# EAGLE design OpenServoDrive (EAGLE 6.3)
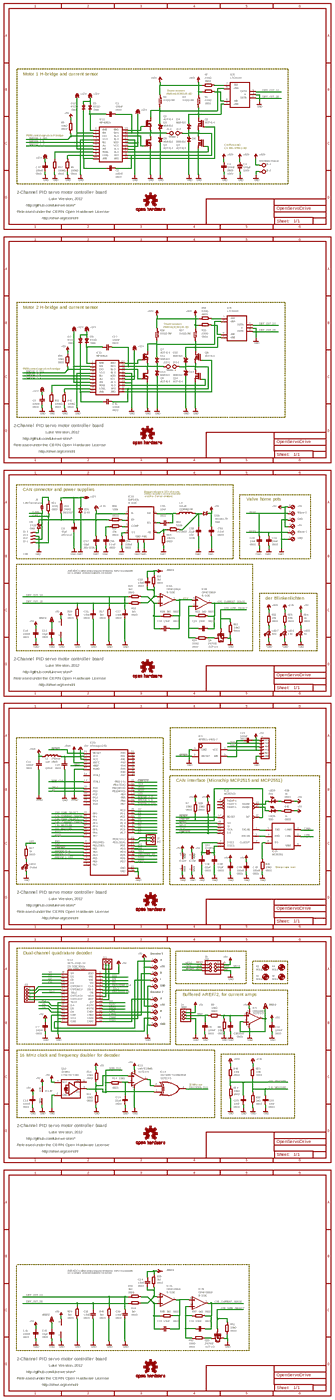
[diagram p0: schematic, sheet 1, overview]
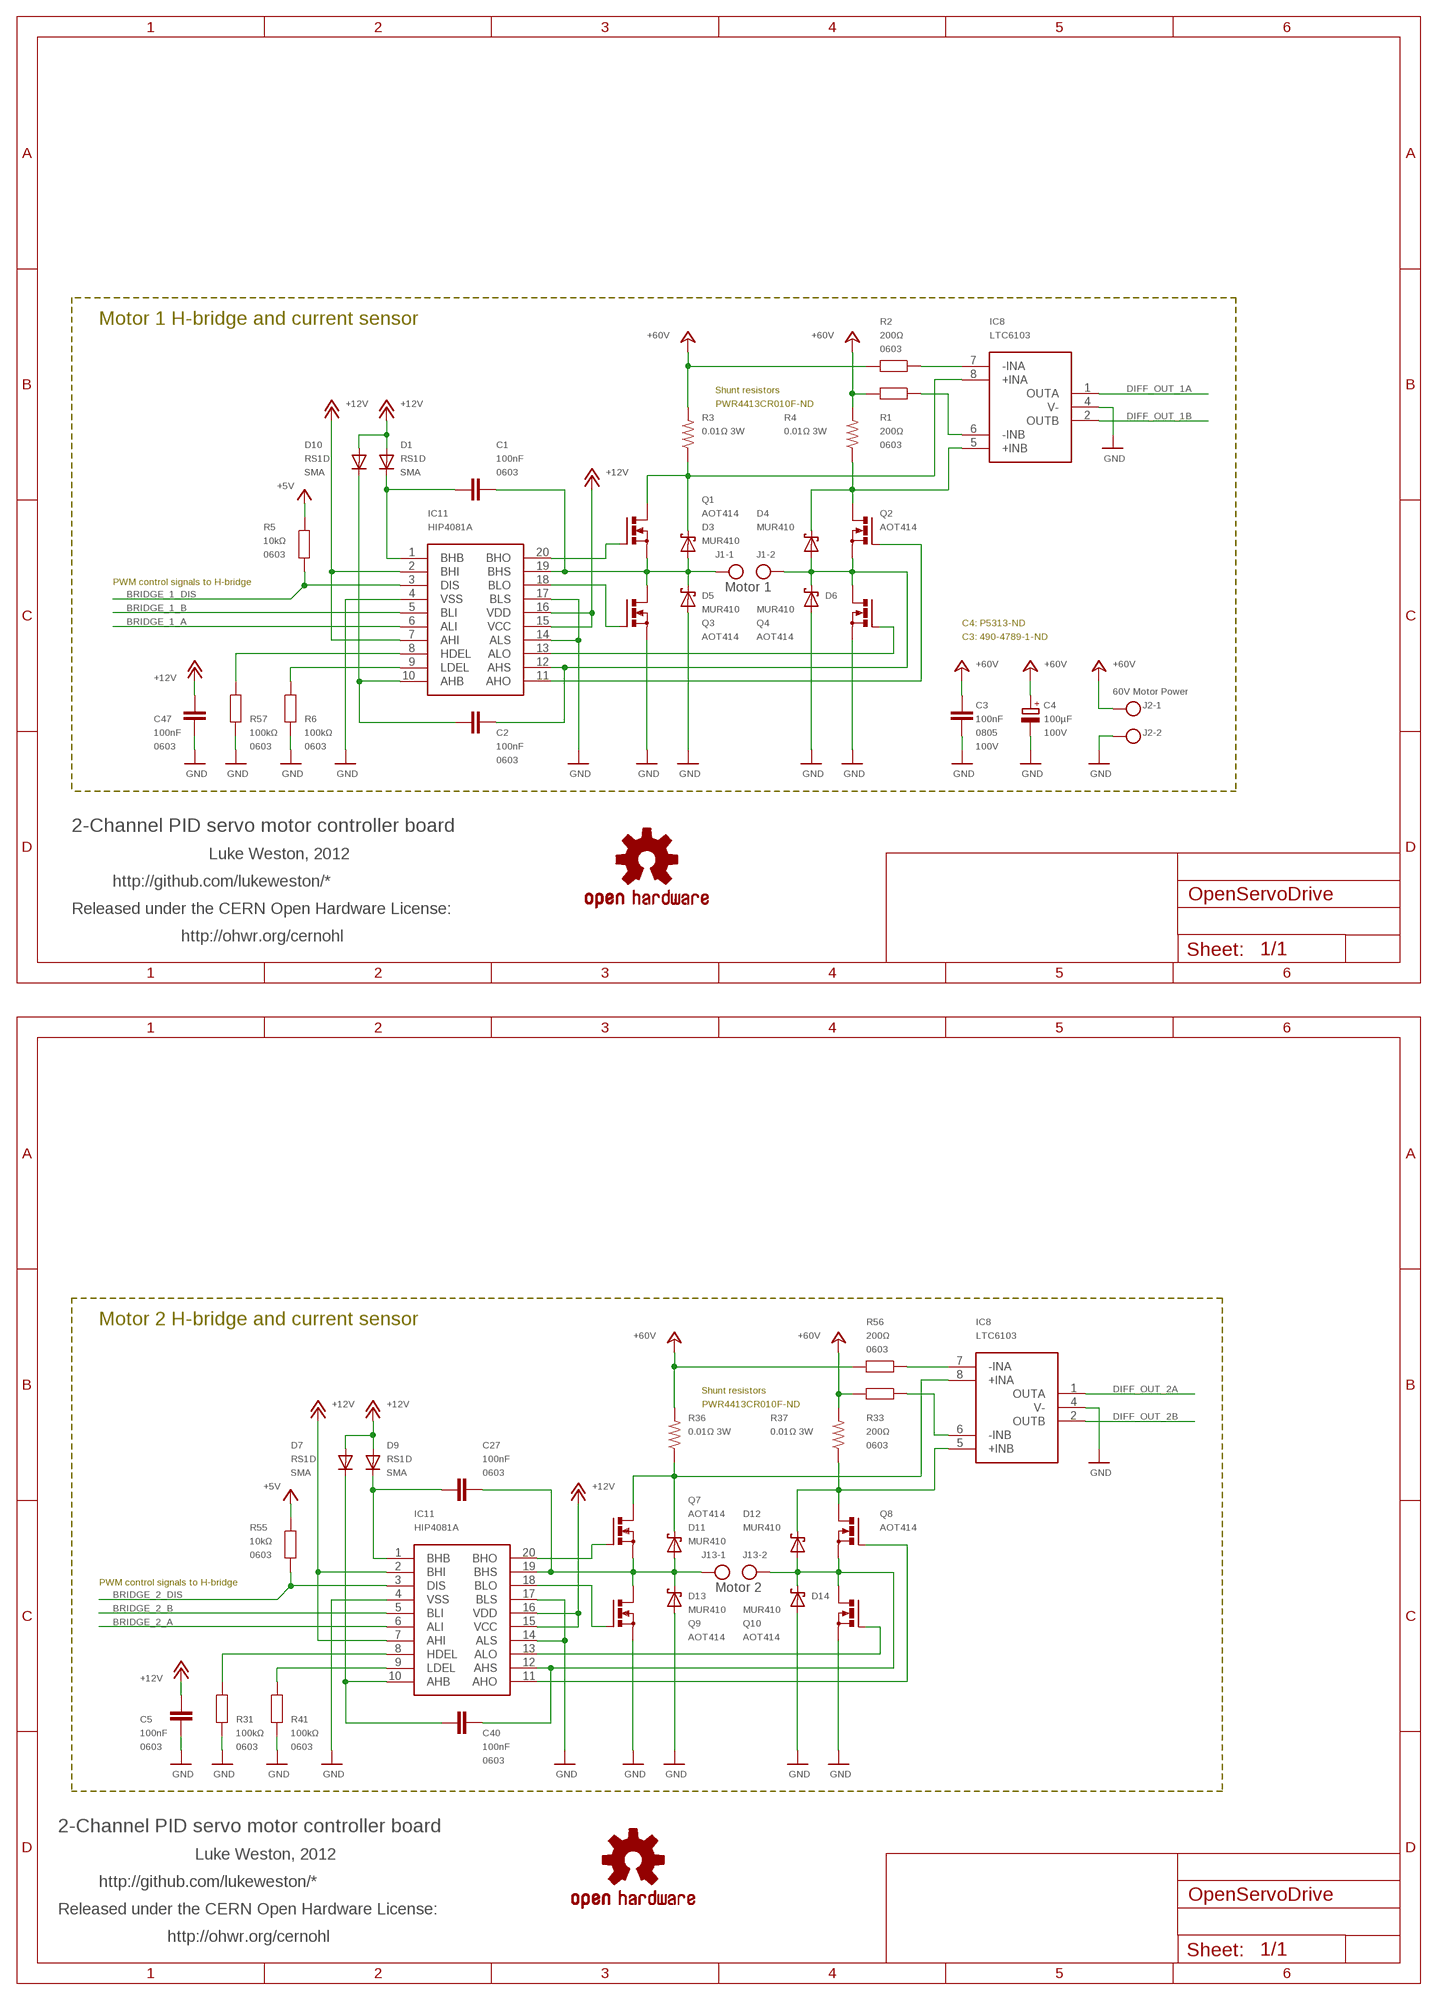
[diagram p1: schematic, sheet 1, part 1 of 4]
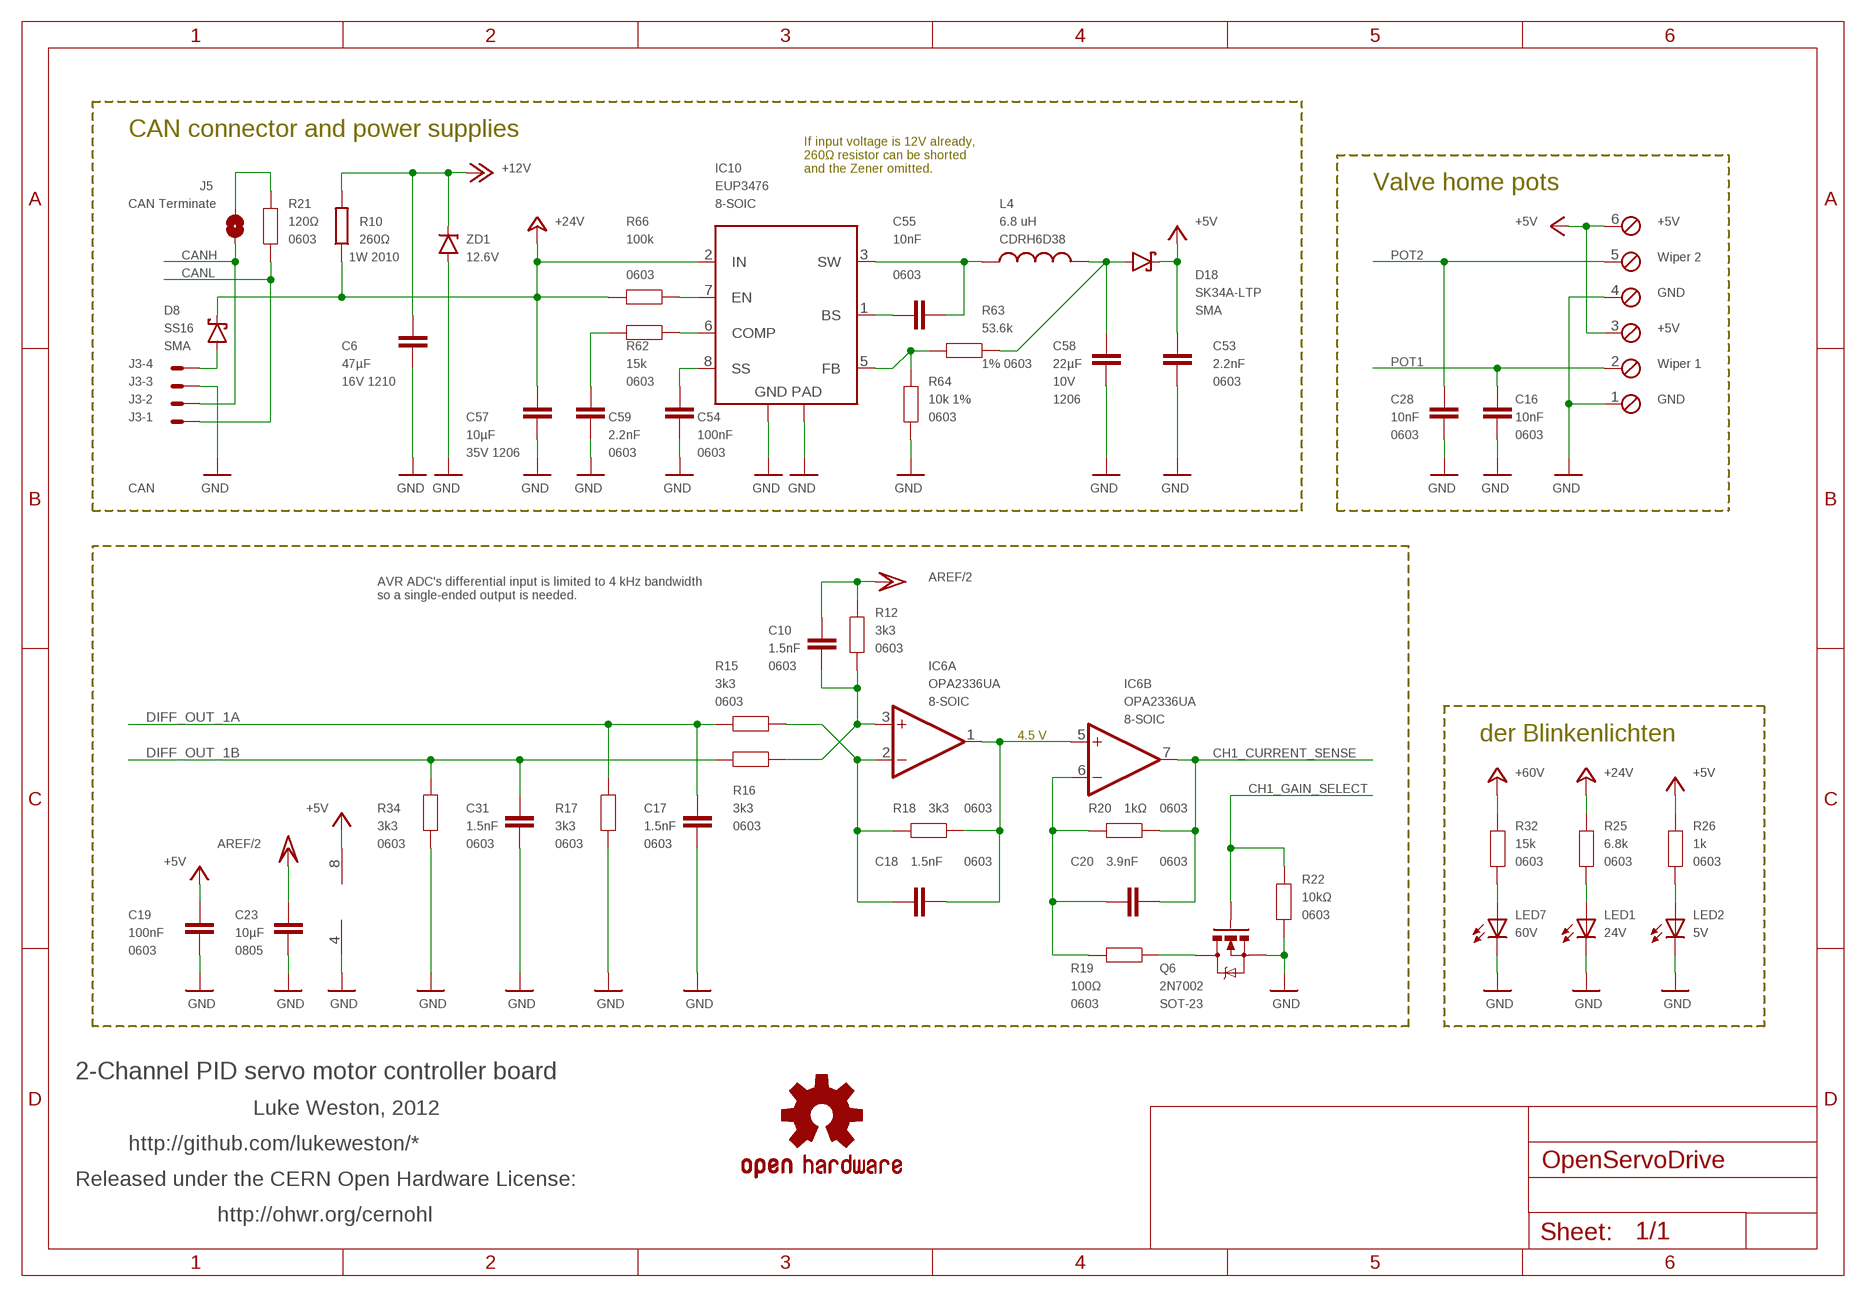
[diagram p2: schematic, sheet 1, part 2 of 4]
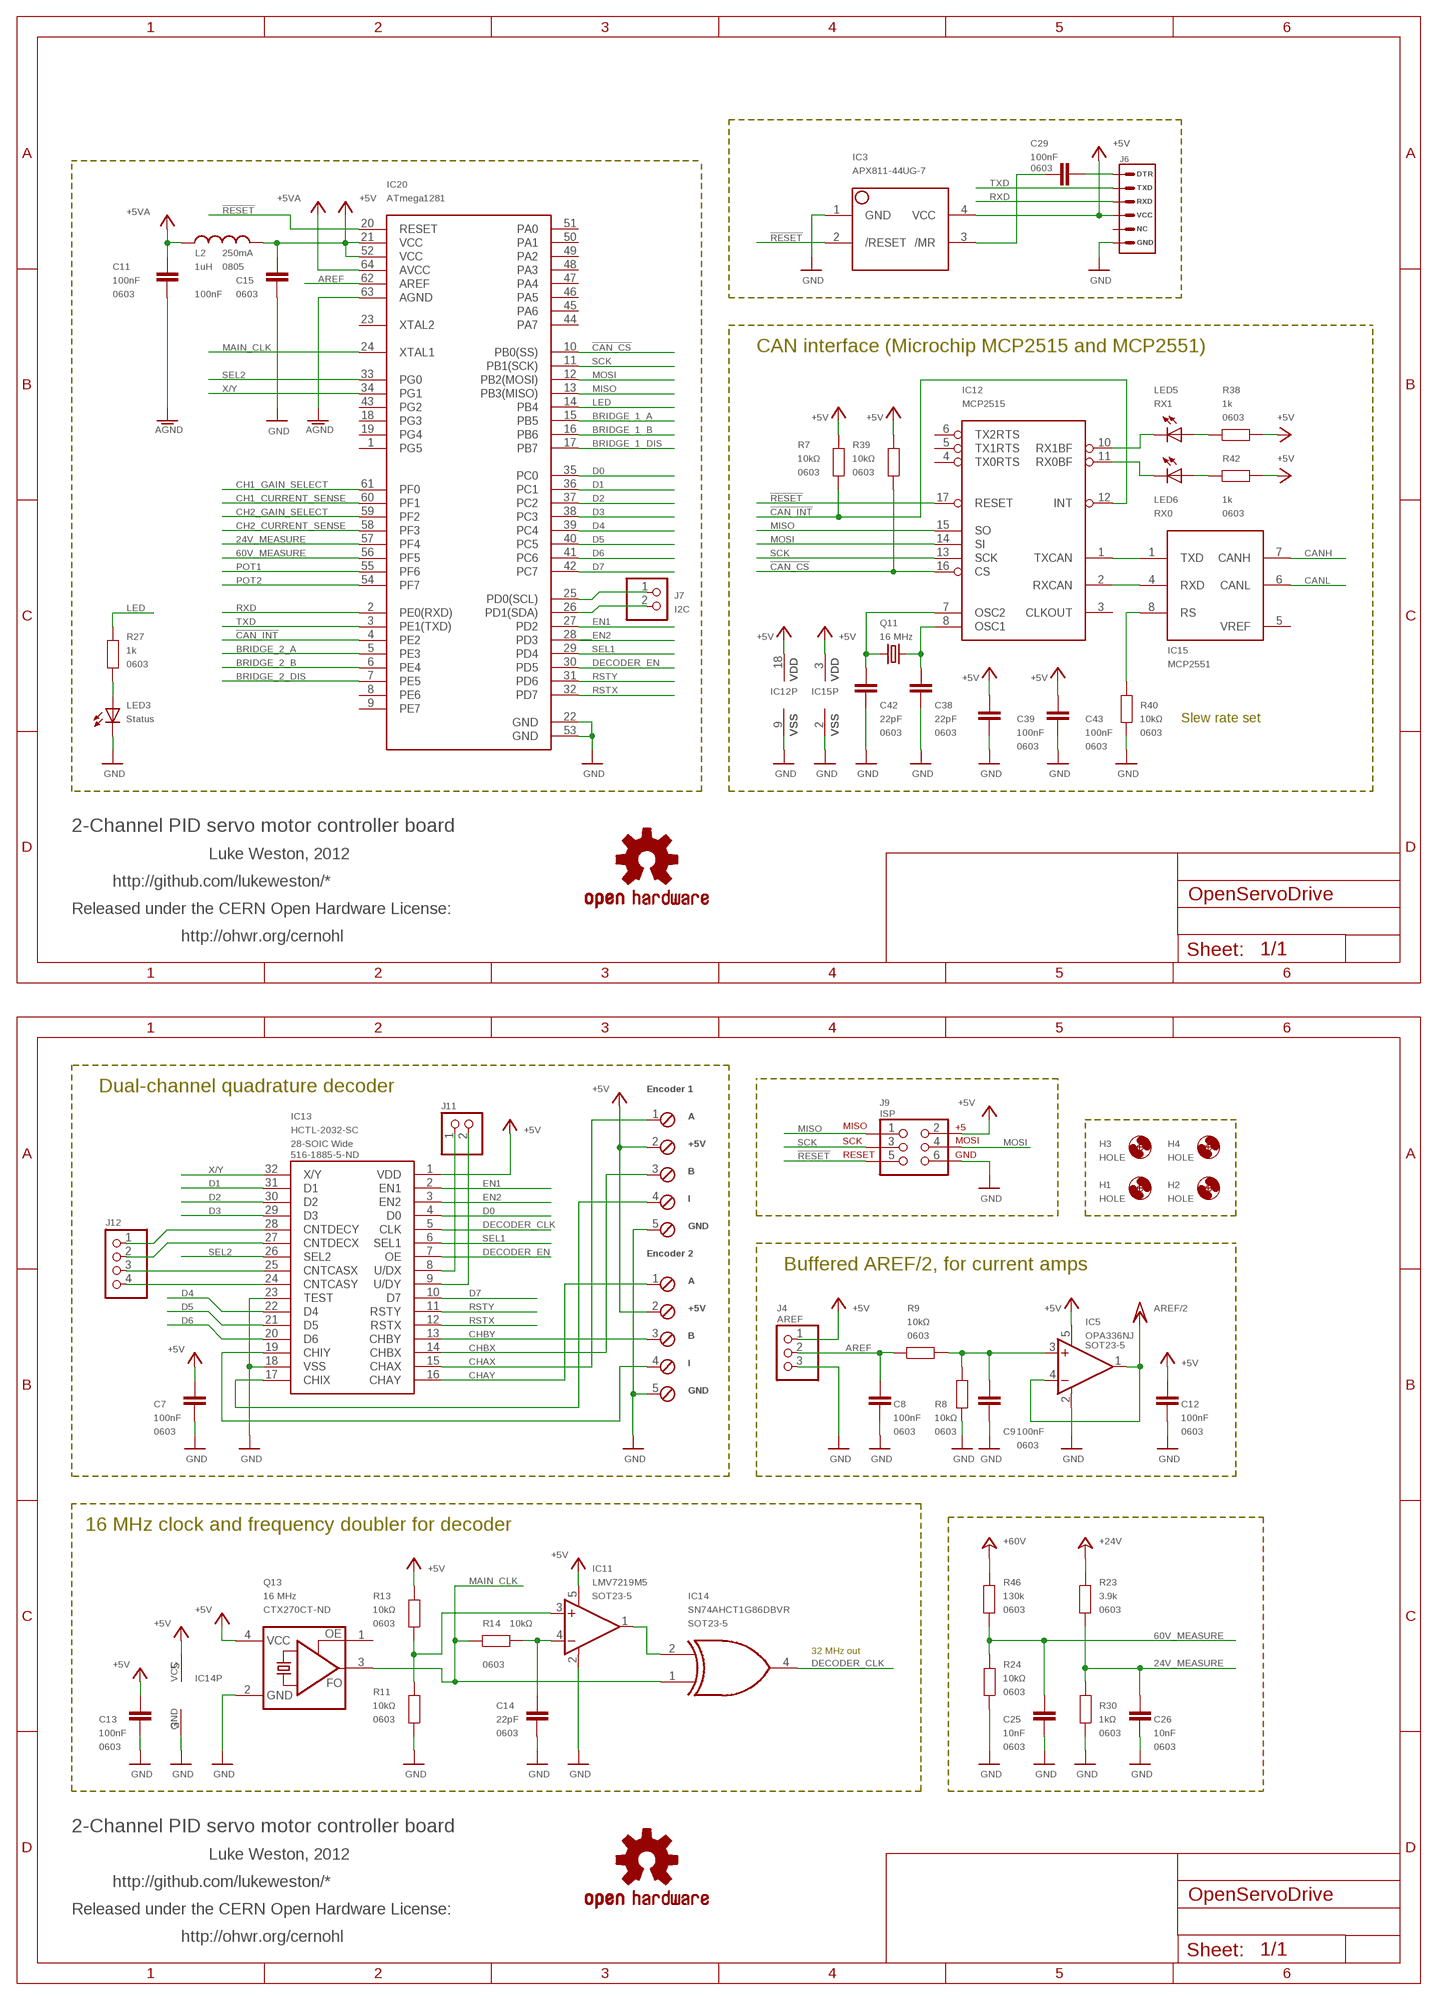
[diagram p3: schematic, sheet 1, part 3 of 4]
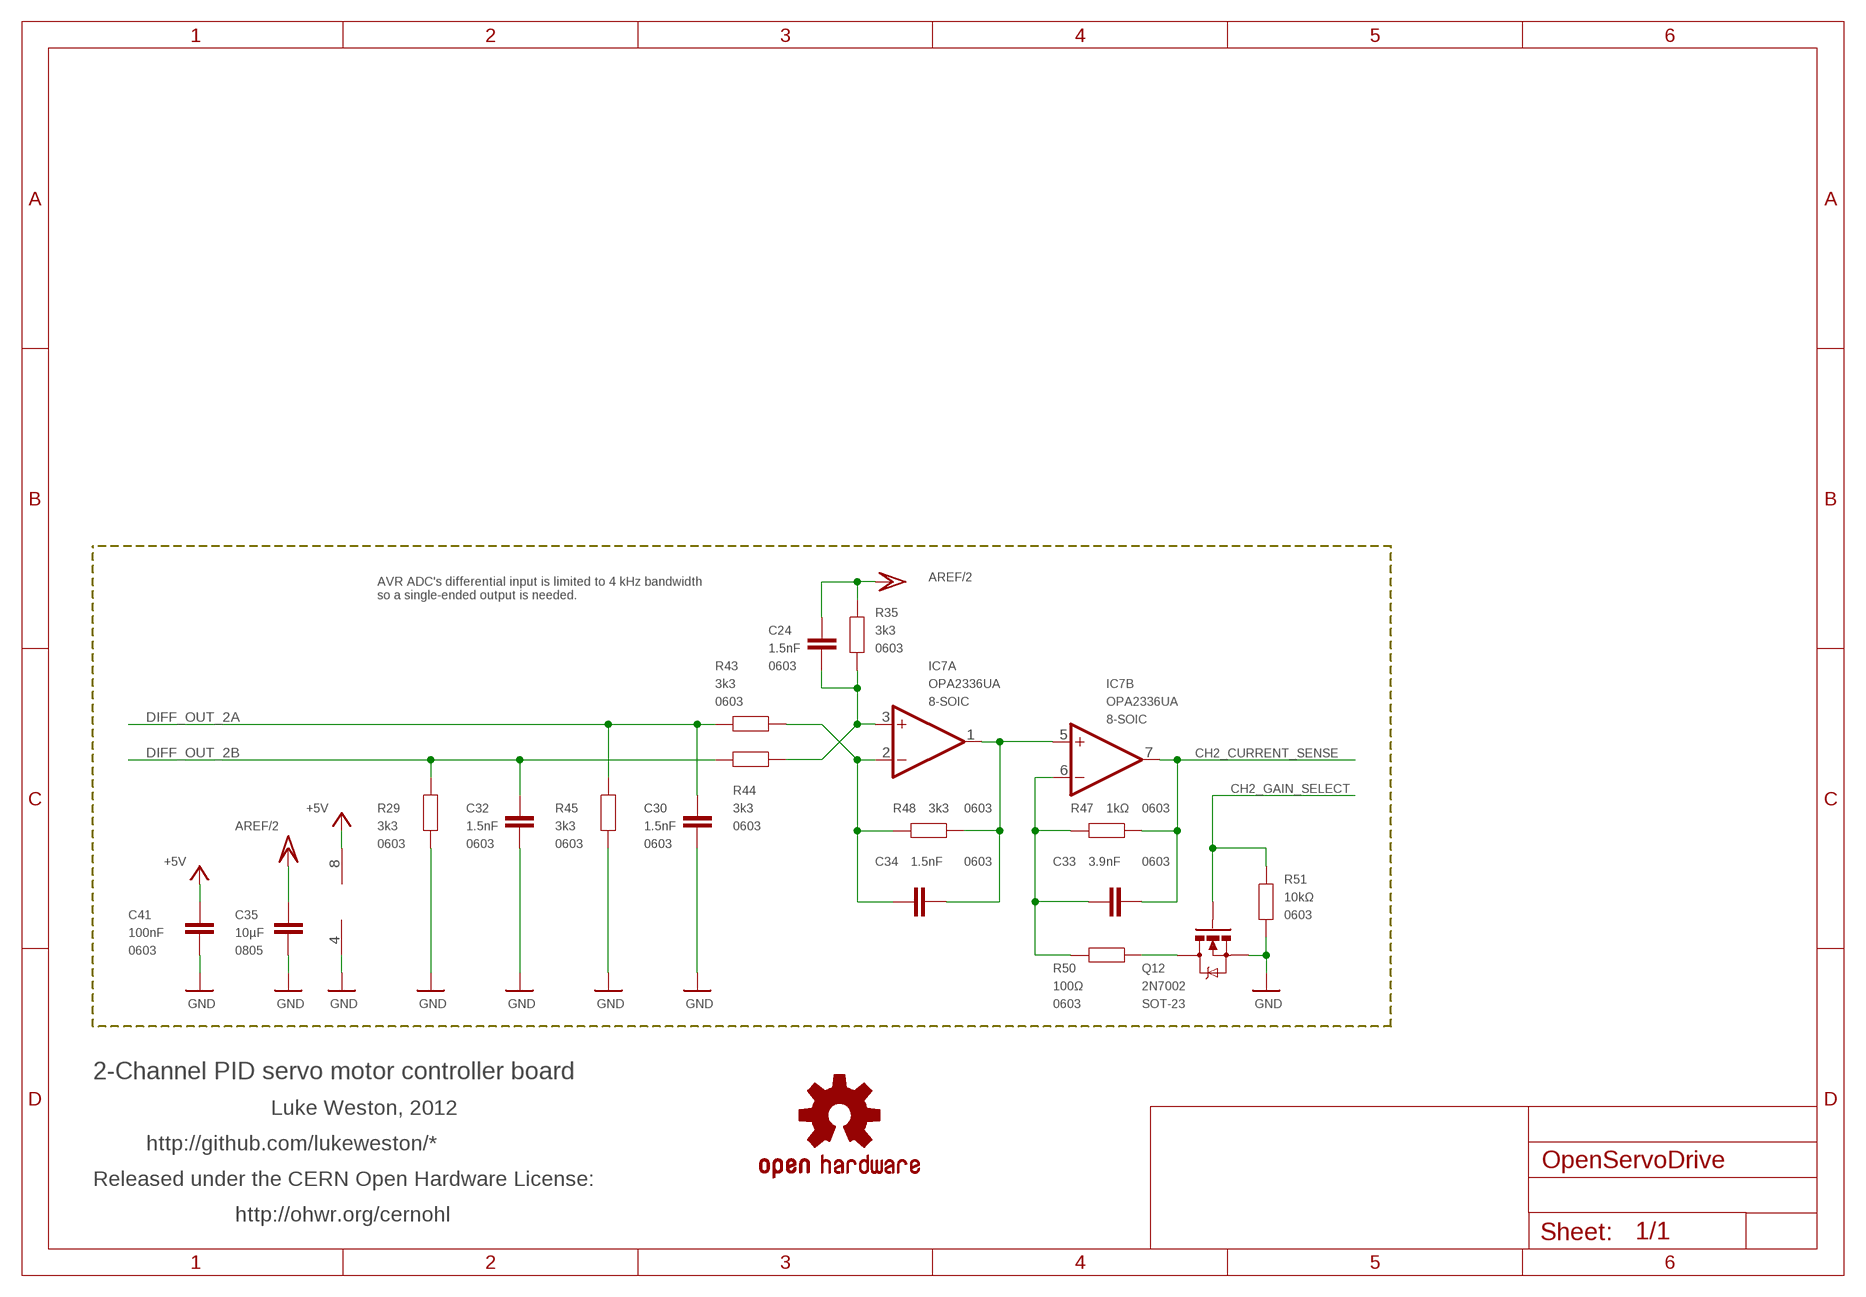
[diagram p4: schematic, sheet 1, part 4 of 4]

## Parts
C1  100nF  CAP0603  [0603]
C2  100nF  CAP0603  [0603]
C3  100nF  CAP0805  [0805]
C4  100µF  CPOL-EUE5-10.5  [E5-10,5]
C5  100nF  CAP0603  [0603]
C6  47µF  C-EUC1210  [C1210]
C7  100nF  CAP0603  [0603]
C8  100nF  CAP0603  [0603]
C9  100nF  CAP0603  [0603]
C10  1.5nF  CAP0603  [0603]
C11  100nF  CAP0603  [0603]
C12  100nF  CAP0603  [0603]
C13  100nF  CAP0603  [0603]
C14  22pF  CAP0603  [0603]
C15  100nF  CAP0603  [0603]
C16  10nF  CAP0603  [0603]
C17  1.5nF  CAP0603  [0603]
C18  1.5nF  CAP0603  [0603]
C19  100nF  CAP0603  [0603]
C20  3.9nF  CAP0603  [0603]
C23  10µF  CAP0805  [0805]
C24  1.5nF  CAP0603  [0603]
C25  10nF  CAP0603  [0603]
C26  10nF  CAP0603  [0603]
C27  100nF  CAP0603  [0603]
C28  10nF  CAP0603  [0603]
C29  100nF  CAP0603  [0603]
C30  1.5nF  CAP0603  [0603]
C31  1.5nF  CAP0603  [0603]
C32  1.5nF  CAP0603  [0603]
C33  3.9nF  CAP0603  [0603]
C34  1.5nF  CAP0603  [0603]
C35  10µF  CAP0805  [0805]
C38  22pF  CAP0603  [0603]
C39  100nF  CAP0603  [0603]
C40  100nF  CAP0603  [0603]
C41  100nF  CAP0603  [0603]
C42  22pF  CAP0603  [0603]
C43  100nF  CAP0603  [0603]
C47  100nF  CAP0603  [0603]
C53  2.2nF  CAP0603  [0603]
C54  100nF  CAP0603  [0603]
C55  10nF  CAP0603  [0603]
C57  10µF  C-EUC1206K  [C1206K]
C58  22µF  C-EUC1206K  [C1206K]
C59  2.2nF  CAP0603  [0603]
D1  RS1D  DIODESMA  [SMA-DIODE]
D3  MUR410  SCHOTTKY-DIODEDO201T15  [DO201T15]
D4  MUR410  SCHOTTKY-DIODEDO201T15  [DO201T15]
D5  MUR410  SCHOTTKY-DIODEDO201T15  [DO201T15]
D6  MUR410  SCHOTTKY-DIODEDO201T15  [DO201T15]
D7  RS1D  DIODESMA  [SMA-DIODE]
D8  SS16  SCHOTTKY  [SMA]
D9  RS1D  DIODESMA  [SMA-DIODE]
D10  RS1D  DIODESMA  [SMA-DIODE]
D11  MUR410  SCHOTTKY-DIODEDO201T15  [DO201T15]
D12  MUR410  SCHOTTKY-DIODEDO201T15  [DO201T15]
D13  MUR410  SCHOTTKY-DIODEDO201T15  [DO201T15]
D14  MUR410  SCHOTTKY-DIODEDO201T15  [DO201T15]
D18  SK34A-LTP  SCHOTTKY  [SMA]
H1  HOLE  MOUNT-HOLE3.2  [3,2]
H2  HOLE  MOUNT-HOLE3.2  [3,2]
H3  HOLE  MOUNT-HOLE3.2  [3,2]
H4  HOLE  MOUNT-HOLE3.2  [3,2]
IC1  LTC6103  [SO08]
IC2  HIP4081A  [SO20W]
IC3  APX811-44UG-7  APX81X-RESET-IC  [SOT143-R]
IC5  OPA336NJ  OPA336N  [SOT23-5]
IC6  OPA2336UA  LM358D  [SO08]
IC7  OPA2336UA  LM358D  [SO08]
IC9  LTC6103  [SO08]
IC10  EUP3476  [SO08T]
IC11  LMV7219M5  OPA336N  [SOT23-5]
IC12  MCP2515  MCP2510SO  [SO-18W]
IC13  HCTL-2032-SC  HCTL2032  [SO28W]
IC14  SN74AHCT1G86DBVR  74AHC1G86DBV  [SOT23-5]
IC15  MCP2551  MCP2551SN  [SO-08]
IC16  HIP4081A  [SO20W]
IC20  ATmega1281  ATMEGA128-SMD  [TQFP64_14X14MM]
J1  Motor 1  W237-102  [W237-102]
J2  60V Motor Power  W237-102  [W237-102]
J3  CAN  22-05-7048-04  [7395-04]
J4  AREF  PINHD-1X3  [1X03]
J5  CAN Terminate  SJ  [SJ]
J6  ARDUINO_SERIAL_PROGRAMLONGPADS  [1X06_LONGPADS]
J7  I2C  PINHD-1X2  [1X02]
J9  ISP  AVR_SPI_PRG_6PTH  [2X3]
J11  PINHD-1X2  [1X02]
J12  PINHD-1X4  [1X04]
J13  Motor 2  W237-102  [W237-102]
L2  1uH  L-USL2012C  [L2012C]
L4  6.8 uH  INDUCTOR  [CDRH]
LED1  24V  LED0603  [LED-0603]
LED2  5V  LED0603  [LED-0603]
LED3  Status  LED0603  [LED-0603]
LED5  RX1  LED0603  [LED-0603]
LED6  RX0  LED0603  [LED-0603]
LED7  60V  LED0603  [LED-0603]
Q1  AOT414  PMOSFET_NTO220BH  [TO220BH]
Q2  AOT414  PMOSFET_NTO220BH  [TO220BH]
Q3  AOT414  PMOSFET_NTO220BH  [TO220BH]
Q4  AOT414  PMOSFET_NTO220BH  [TO220BH]
Q6  2N7002  MOSFET-NCHANNELSMD  [SOT23-3]
Q7  AOT414  PMOSFET_NTO220BH  [TO220BH]
Q8  AOT414  PMOSFET_NTO220BH  [TO220BH]
Q9  AOT414  PMOSFET_NTO220BH  [TO220BH]
Q10  AOT414  PMOSFET_NTO220BH  [TO220BH]
Q11  16 MHz  CRYSTALHC49US  [HC49US]
Q12  2N7002  MOSFET-NCHANNELSMD  [SOT23-3]
Q13  16 MHz  ASF1  [ASF]
R1  200Ω  RESISTOR0603  [0603]
R2  200Ω  RESISTOR0603  [0603]
R3  0.01Ω 3W  RSENSE  [RSENSE]
R4  0.01Ω 3W  RSENSE  [RSENSE]
R5  10kΩ  RESISTOR0603  [0603]
R6  100kΩ  RESISTOR0603  [0603]
R7  10kΩ  RESISTOR0603  [0603]
R8  10kΩ  RESISTOR0603  [0603]
R9  10kΩ  RESISTOR0603  [0603]
R10  260Ω  R-EU_R2010  [R2010]
R11  10kΩ  RESISTOR0603  [0603]
R12  3k3  RESISTOR0603  [0603]
R13  10kΩ  RESISTOR0603  [0603]
R14  10kΩ  RESISTOR0603  [0603]
R15  3k3  RESISTOR0603  [0603]
R16  3k3  RESISTOR0603  [0603]
R17  3k3  RESISTOR0603  [0603]
R18  3k3  RESISTOR0603  [0603]
R19  100Ω  RESISTOR0603  [0603]
R20  1kΩ  RESISTOR0603  [0603]
R21  120Ω  RESISTOR0603  [0603]
R22  10kΩ  RESISTOR0603  [0603]
R23  3.9k  RESISTOR0603  [0603]
R24  10kΩ  RESISTOR0603  [0603]
R25  6.8k  RESISTOR0603  [0603]
R26  1k  RESISTOR0603  [0603]
R27  1k  RESISTOR0603  [0603]
R29  3k3  RESISTOR0603  [0603]
R30  1kΩ  RESISTOR0603  [0603]
R31  100kΩ  RESISTOR0603  [0603]
R32  15k  RESISTOR0603  [0603]
R33  200Ω  RESISTOR0603  [0603]
R34  3k3  RESISTOR0603  [0603]
R35  3k3  RESISTOR0603  [0603]
R36  0.01Ω 3W  RSENSE  [RSENSE]
R37  0.01Ω 3W  RSENSE  [RSENSE]
R38  1k  RESISTOR0603  [0603]
R39  10kΩ  RESISTOR0603  [0603]
R40  10kΩ  RESISTOR0603  [0603]
R41  100kΩ  RESISTOR0603  [0603]
R42  1k  RESISTOR0603  [0603]
R43  3k3  RESISTOR0603  [0603]
R44  3k3  RESISTOR0603  [0603]
R45  3k3  RESISTOR0603  [0603]
R46  130k  RESISTOR0603  [0603]
R47  1kΩ  RESISTOR0603  [0603]
R48  3k3  RESISTOR0603  [0603]
R50  100Ω  RESISTOR0603  [0603]
R51  10kΩ  RESISTOR0603  [0603]
R55  10kΩ  RESISTOR0603  [0603]
R56  200Ω  RESISTOR0603  [0603]
R57  100kΩ  RESISTOR0603  [0603]
R62  15k  RESISTOR0603  [0603]
R63  53.6k  RESISTOR0603  [0603]
R64  10k 1%  RESISTOR0603  [0603]
R66  100k  RESISTOR0603  [0603]
U$1  OSHW-LOGOS  [OSHW-LOGO-S]
U$2  OSHW-LOGOS  [OSHW-LOGO-S]
U$5  OSHW-LOGOS  [OSHW-LOGO-S]
U$55  OSHW-LOGOS  [OSHW-LOGO-S]
U$56  OSHW-LOGOS  [OSHW-LOGO-S]
U$68  OSHW-LOGOS  [OSHW-LOGO-S]
X1  MPT6  [6POL254]
X2  MPT5  [5POL254]
X3  MPT5  [5POL254]
ZD1  12.6V  ZENERMINIMELF  [MINIMELF]

## Nets
24V_MEASURE: C26.2 IC20.57(PF4) R23.1 R30.1
60V_MEASURE: C25.2 IC20.56(PF5) R24.1 R46.1
!CAN_CS: IC12.16(CS) IC20.10(PB0(SS)) R39.2
!CAN_INT: IC12.12(INT) IC20.4(PE2) R7.2
!RESET: IC3.2(/RESET) IC12.17(RESET) IC20.20(RESET) J9.5
+5V: C7.2 C12.2 C13.2 C15.1 C19.1 C39.2 C41.1 C43.2 C53.2 D18.K IC3.4(VCC) IC5.5(V+) IC6.8(P:V+) IC7.8(P:V+) IC11.5(V+) IC12.18(VDD) IC13.1(VDD) IC14.5(VCC) IC15.3(VDD) IC20.21(VCC) IC20.52(VCC) IC20.64(AVCC) J4.1 J6.4(VCC) J9.2 L2.2 Q13.4(VCC) R5.2 R7.1 R13.1 R26.1 R38.2 R39.1 R42.2 R55.2 X1.3 X1.6 X2.2 X3.2 ; supply symbol labelled +5VA
+5VA: C11.1 L2.1
+12V: C5.1 C6.1 C47.1 D1.A D7.A D9.A D10.A IC2.2(BHI) IC2.7(AHI) IC2.15(VCC) IC2.16(VDD) IC16.2(BHI) IC16.7(AHI) IC16.15(VCC) IC16.16(VDD) R10.2 ZD1.K
+24V: C57.1 D8.K IC10.2(IN) R10.1 R23.2 R25.1 R66.2
+60V: C3.2 C4.+ J2.1 R1.2 R2.2 R3.P$2 R4.P$2 R32.1 R33.2 R36.P$2 R37.P$2 R46.2 R56.2
AGND: C11.2 IC20.63(AGND)
AREF: C8.2 IC20.62(AREF) J4.2 R9.1
AREF/2: C10.1 C23.1 C24.1 C35.1 IC5.1(OUT) IC5.4(-IN) R12.2 R35.2
BRIDGE_1_A: IC2.6(ALI) IC20.15(PB5)
BRIDGE_1_B: IC2.5(BLI) IC20.16(PB6)
BRIDGE_1_DIS: IC2.3(DIS) IC20.17(PB7) R5.1
BRIDGE_2_A: IC16.6(ALI) IC20.5(PE3)
BRIDGE_2_B: IC16.5(BLI) IC20.6(PE4)
BRIDGE_2_DIS: IC16.3(DIS) IC20.7(PE5) R55.1
CANH: IC15.7(CANH) J3.2 J5.2
CANL: IC15.6(CANL) J3.1 R21.1
CH1_CURRENT_SENSE: C20.2 IC6.7(B:OUT) IC20.60(PF1) R20.1
CH1_GAIN_SELECT: IC20.61(PF0) Q6.1(G) R22.2
CH2_CURRENT_SENSE: C33.2 IC7.7(B:OUT) IC20.58(PF3) R47.1
CH2_GAIN_SELECT: IC20.59(PF2) Q12.1(G) R51.2
CHAX: IC13.15(CHAX) X2.1
CHAY: IC13.16(CHAY) X3.1
CHBX: IC13.14(CHBX) X2.3
CHBY: IC13.13(CHBY) X3.3
CHIX: IC13.17(CHIX) X2.4
CHIY: IC13.19(CHIY) X3.4
D0: IC13.4(D0) IC20.35(PC0)
D1: IC13.31(D1) IC20.36(PC1)
D2: IC13.30(D2) IC20.37(PC2)
D3: IC13.29(D3) IC20.38(PC3)
D4: IC13.22(D4) IC20.39(PC4)
D5: IC13.21(D5) IC20.40(PC5)
D6: IC13.20(D6) IC20.41(PC6)
D7: IC13.10(D7) IC20.42(PC7)
DECODER_CLK: IC13.5(CLK) IC14.4(O)
DECODER_EN: IC13.7(OE) IC20.30(PD5)
DIFF_OUT_1A: C17.1 IC1.1(OUTA) R15.2 R17.2
DIFF_OUT_1B: C31.1 IC1.2(OUTB) R16.2 R34.2
DIFF_OUT_2A: C30.1 IC9.1(OUTA) R43.2 R45.2
DIFF_OUT_2B: C32.1 IC9.2(OUTB) R29.2 R44.2
EN1: IC13.2(EN1) IC20.27(PD2)
EN2: IC13.3(EN2) IC20.28(PD3)
GND: C3.1 C4.- C5.2 C6.2 C7.1 C8.1 C9.1 C12.1 C13.1 C14.1 C15.2 C16.2 C17.2 C19.2 C23.2 C25.1 C26.1 C28.2 C30.2 C31.2 C32.2 C35.2 C38.1 C39.1 C41.2 C42.1 C43.1 C47.2 C53.1 C54.1 C57.2 C58.2 C59.1 D5.A D6.A D13.A D14.A IC1.4(V-) IC2.4(VSS) IC2.14(ALS) IC2.17(BLS) IC3.1(GND) IC5.2(V-) IC6.4(P:V-) IC7.4(P:V-) IC9.4(V-) IC10.4(GND) IC10.9(TGND) IC11.2(V-) IC12.9(VSS) IC13.18(VSS) IC13.23(TEST) IC14.3(GND) IC15.2(VSS) IC16.4(VSS) IC16.14(ALS) IC16.17(BLS) IC20.22(GND) IC20.53(GND) J2.2 J3.3 J4.3 J6.6(GND) J9.6 LED1.C LED2.C LED3.C LED7.C Q3.S Q4.S Q6.2(S) Q9.S Q10.S Q12.2(S) Q13.2(GND) R6.1 R8.2 R11.2 R17.1 R22.1 R24.2 R29.1 R30.2 R31.1 R34.1 R40.2 R41.1 R45.1 R51.1 R57.1 R64.2 X1.1 X1.4 X2.5 X3.5 ZD1.A
LED: IC20.14(PB4) R27.1
MAIN_CLK: IC14.1(I0) IC20.24(XTAL1) Q13.3(FO) R14.1
MISO: IC12.15(SO) IC20.13(PB3(MISO)) J9.1
MOSI: IC12.14(SI) IC20.12(PB2(MOSI)) J9.4
N$1: IC13.28(CNTDECY) J12.1
N$2: C34.1 IC7.2(A:-IN) R43.1 R48.2
N$3: C14.2 IC11.4(-IN) R14.2
N$4: IC11.1(OUT) IC14.2(I1)
N$5: IC11.3(+IN) R11.1 R13.2
N$6: IC1.7(-INA) R2.1
N$7: IC13.25(CNTCASX) J12.3
N$8: IC13.24(CNTCASY) J12.4
N$9: IC13.27(CNTDECX) J12.2
N$10: IC13.8(U/DX) J11.1
N$11: C24.2 IC7.3(A:+IN) R35.1 R44.1
N$12: IC13.9(U/DY) J11.2
N$13: LED2.A R26.2
N$14: C9.2 IC5.3(+IN) R8.1 R9.2
N$15: IC1.6(-INB) R1.1
N$16: C33.1 IC7.6(B:-IN) R47.2 R50.2
N$17: Q12.3(D) R50.1
N$18: C34.2 IC7.1(A:OUT) IC7.5(B:+IN) R48.1
N$19: IC20.26(PD1(SDA)) J7.2
N$20: IC20.25(PD0(SCL)) J7.1
N$22: C18.1 IC6.2(A:-IN) R15.1 R18.2
N$23: C29.2 IC3.3(/MR)
N$24: C29.1 J6.1(DTR)
N$25: C10.2 IC6.3(A:+IN) R12.1 R16.1
N$30: D8.A J3.4
N$31: J5.1 R21.2
N$35: C20.1 IC6.6(B:-IN) R19.2 R20.2
N$36: Q6.3(D) R19.1
N$37: C2.2 D4.A D6.C IC2.12(AHS) J1.2 Q2.S Q4.D
N$38: C18.2 IC6.1(A:OUT) IC6.5(B:+IN) R18.1
N$40: D4.C IC1.5(+INB) Q2.D R4.P$1
N$41: C1.2 D3.A D5.C IC2.19(BHS) J1.1 Q1.S Q3.D
N$42: IC10.7(EN) R66.1
N$43: LED1.A R25.2
N$44: C55.1 IC10.3(SW) L4.1
N$45: D3.C IC1.8(+INA) Q1.D R3.P$1
N$46: IC2.20(BHO) Q1.G
N$47: IC2.18(BLO) Q3.G
N$48: IC2.13(ALO) Q4.G
N$49: IC2.11(AHO) Q2.G
N$50: LED3.A R27.2
N$51: C55.2 IC10.1(BS)
N$53: IC12.1(TXCAN) IC15.1(TXD)
N$54: IC12.2(RXCAN) IC15.4(RXD)
N$55: LED7.A R32.2
N$56: C38.2 IC12.8(OSC1) Q11.2
N$57: C42.2 IC12.7(OSC2) Q11.1
N$58: IC12.11(RX0BF) LED6.C
N$59: C59.2 R62.2
N$60: C2.1 D10.C IC2.10(AHB)
N$61: IC10.6(COMP) R62.1
N$62: C54.2 IC10.8(SS)
N$63: IC10.5(FB) R63.2 R64.1
N$65: C58.1 D18.A L4.2 R63.1
N$66: C1.1 D1.C IC2.1(BHB)
N$71: C40.2 D12.A D14.C IC16.12(AHS) J13.2 Q8.S Q10.D
N$74: D12.C IC9.5(+INB) Q8.D R37.P$1
N$75: C27.2 D11.A D13.C IC16.19(BHS) J13.1 Q7.S Q9.D
N$76: IC2.9(LDEL) R6.2
N$77: IC2.8(HDEL) R57.2
N$80: D11.C IC9.8(+INA) Q7.D R36.P$1
N$81: IC16.20(BHO) Q7.G
N$82: IC16.18(BLO) Q9.G
N$83: IC16.13(ALO) Q10.G
N$84: IC12.10(RX1BF) LED5.C
N$85: LED6.A R42.1
N$86: LED5.A R38.1
N$87: IC15.8(RS) R40.1
N$88: IC16.11(AHO) Q8.G
N$89: C40.1 D7.C IC16.10(AHB)
N$93: C27.1 D9.C IC16.1(BHB)
N$94: IC16.9(LDEL) R41.2
N$95: IC16.8(HDEL) R31.2
N$96: IC9.7(-INA) R56.1
N$97: IC9.6(-INB) R33.1
POT1: C16.1 IC20.55(PF6) X1.2
POT2: C28.1 IC20.54(PF7) X1.5
RSTX: IC13.12(RSTX) IC20.32(PD7)
RSTY: IC13.11(RSTY) IC20.31(PD6)
RXD: IC20.2(PE0(RXD)) J6.3(TXO)
SCK: IC12.13(SCK) IC20.11(PB1(SCK)) J9.3
SEL1: IC13.6(SEL1) IC20.29(PD4)
SEL2: IC13.26(SEL2) IC20.33(PG0)
TXD: IC20.3(PE1(TXD)) J6.2(RXI)
X/Y: IC13.32(X/Y) IC20.34(PG1)
Unconnected: IC12.3(CLKOUT) IC12.4(TX0RTS) IC12.5(TX1RTS) IC12.6(TX2RTS) IC20.1(PG5) IC20.8(PE6) IC20.9(PE7) IC20.18(PG3) IC20.19(PG4) IC20.23(XTAL2) IC20.43(PG2) IC20.44(PA7) IC20.45(PA6) IC20.46(PA5) IC20.47(PA4) IC20.48(PA3) IC20.49(PA2) IC20.50(PA1) IC20.51(PA0) J6.5(CTS) Q13.1(OE)

## Notes on the sheet
- Motor 1 H-bridge and current sensor | IC8
- LTC6103
- Shunt resistors
- PWR4413CR010F-ND
- IC11
- HIP4081A
- PWM control signals to H-bridge
- C4: P5313-ND
- C3: 490-4789-1-ND
- 2-Channel PID servo motor controller board
- Luke Weston, 2012
- http://github.com/lukeweston/*
- Released under the CERN Open Hardware License:
- http://ohwr.org/cernohl
- Motor 2 H-bridge and current sensor | IC8
- LTC6103
- Shunt resistors
- PWR4413CR010F-ND
- IC11
- HIP4081A
- PWM control signals to H-bridge
- 2-Channel PID servo motor controller board
- Luke Weston, 2012
- http://github.com/lukeweston/*
- Released under the CERN Open Hardware License:
- http://ohwr.org/cernohl
- CAN connector and power supplies
- If input voltage is 12V already,
  260Ω resistor can be shorted
  and the Zener omitted.
- Valve home pots
- +5V
- Wiper 2
- GND
- +5V
- Wiper 1
- GND
- AVR ADC's differential input is limited to 4 kHz bandwidth
  so a single-ended output is needed.
- 4.5 V | der Blinkenlichten
- 2-Channel PID servo motor controller board
- Luke Weston, 2012
- http://github.com/lukeweston/*
- Released under the CERN Open Hardware License:
- http://ohwr.org/cernohl
- CAN interface (Microchip MCP2515 and MCP2551)
- Slew rate set
- 2-Channel PID servo motor controller board
- Luke Weston, 2012
- http://github.com/lukeweston/*
- Released under the CERN Open Hardware License:
- http://ohwr.org/cernohl
- Dual-channel quadrature decoder | Encoder 1
- A
- HCTL-2032-SC
- 28-SOIC Wide | +5V
- 516-1885-5-ND
- B
- I
- GND
- Encoder 2
- Buffered AREF/2, for current amps
- A
- +5V
- B
- I
- GND
- 16 MHz clock and frequency doubler for decoder
- 32 MHz out
- 2-Channel PID servo motor controller board
- Luke Weston, 2012
- http://github.com/lukeweston/*
- Released under the CERN Open Hardware License:
- http://ohwr.org/cernohl
- AVR ADC's differential input is limited to 4 kHz bandwidth
  so a single-ended output is needed.
- 2-Channel PID servo motor controller board
- Luke Weston, 2012
- http://github.com/lukeweston/*
- Released under the CERN Open Hardware License:
- http://ohwr.org/cernohl

## Power pins joined to a net without a drawn wire
VREF: IC15.5(VREF)

## Library data of the parts
C1 C2 C5 C7-C20 C24-C34 C38-C43 C47 C53-C55 C59 = freetronics-master-v1:CAP: Capacitor Standard 0603 ceramic capacitor, and 0.1" leaded capacitor.; PACKAGE: 0603
C3 = freetronics-master-v1:CAP: Capacitor Standard 0603 ceramic capacitor, and 0.1" leaded capacitor.; PACKAGE: 0805; VOLTAGE: 100V
C4 = rcl:CPOL-EU: POLARIZED CAPACITOR, European symbol; VOLTAGE: 100V
C6 = freetronics-jon:C-EU: CAPACITOR, European symbol; VOLTAGE: 16V 1210
C23 C35 = freetronics-master-v1:CAP: Capacitor Standard 0603 ceramic capacitor, and 0.1" leaded capacitor.; PACKAGE: 0805
C57 = freetronics-jon:C-EU: CAPACITOR, European symbol; VOLTAGE: 35V 1206
C58 = freetronics-jon:C-EU: CAPACITOR, European symbol; PACKAGE: 1206; VOLTAGE: 10V
D1 D7 D9 D10 = freetronics-master-v1:DIODE: Diode These are standard reverse protection diodes and small signal diodes. SMA package can handle up to about 1A. SOD-323 can handle about 200mA. What the SOD-323 package when ordering, there are some mfgs out there that are 5-pin packages.; PACKAGE: SMA
D3-D6 D11-D14 = diode:SCHOTTKY-DIODE: Schottky Diode
D8 D18 = freetronics-luke:SCHOTTKY; PACKAGE: SMA
H1-H4 = holes:MOUNT-HOLE: MOUNTING HOLE with drill center marker
IC1 IC9 = ltc6103:LTC6103
IC2 IC16 = cube:HIP4081A
IC3 = freetronics-master-v1:APX81X-RESET-IC
IC5 IC11 = burr-brown:OPA336: CMOS Operational Amplifiers Single-Supply, MicroPower, MicroAmplifier(TM) Series; MPN: OPA336NA; OC_FARNELL: 1212297; OC_NEWARK: 01M8405; PACKAGE: SOT23-5
IC6 IC7 = linear:LM358: OP AMP also LM158; LM258; LM2904 Source: http://cache.national.com/ds/LM/LM158.pdf; PACKAGE: 8-SOIC
IC10 = freetronics-luke:EUP3476: EUTECH EUP3476 buck converter; PACKAGE: 8-SOIC
IC12 = microchip_can:MCP2510
IC13 = cube:HCTL2032
IC14 = 74xx-little-us:74*1G86: 2-input EXCLUSIV-OR gate; PACKAGE: SOT23-5
IC15 = microchip_can:MCP2551: High Speed CAN tranceiver
IC20 = SparkFun:ATMEGA128: ATmega128/128L/1281/2561. Note: The ATmega128 pin 1 is PEN and the ATmega256/1281 pin 1 is PG5.
J1 J2 J13 = con-wago-500:W237-102: WAGO SCREW CLAMP; MPN: 237-102; OC_FARNELL: unknown; OC_NEWARK: 70K9898
J3 = con-molex:22-?-04: CONNECTOR wire to board 2.54 mm (.1 inch) pitch header; OC_FARNELL: unknown; OC_NEWARK: unknown
J4 = pinhead:PINHD-1X3: PIN HEADER
J5 = freetronics-luke:SJ: PCB "solder jumper". Note that there should nothing on the BOM corresponding to this "component".
J6 = SparkFun:ARDUINO_SERIAL_PROGRAM
J7 J11 = pinhead:PINHD-1X2: PIN HEADER
J9 = SparkFun:AVR_SPI_PRG_6: AVR ISP 6 Pin This is the reduced ISP connector for AVR programming. Common on Arduino. This footprint will take up less PCB space and can be used with a 10-pin to 6-pin adapter such as SKU: BOB-08508
J12 = pinhead:PINHD-1X4: PIN HEADER
L2 = rcl:L-US: INDUCTOR, American symbol; CURRENT: 250mA; PACKAGE: 0805
L4 = freetronics-luke:INDUCTOR; PACKAGE: CDRH6D38
LED1-LED3 LED5-LED7 = freetronics-master-v1:LED: LEDs Standard schematic elements and footprints for 5mm, 3mm, 1206, and 0603 sized LEDs. 5mm - Spark Fun Electronics SKU : COM-00529 (and others)
Q1-Q4 Q7-Q10 = transistor-power:PMOSFET_N: Power MOSFET N-Channel
Q6 Q12 = freetronics-master-v1:MOSFET-NCHANNEL; PACKAGE: SOT-23
Q11 = SparkFun:CRYSTAL: Crystals Various standard crystals. Proven footprints. Spark Fun Electronics SKU : COM-00534
Q13 = crystal:ASF*: CRYSTAL CLOCK OSCILLATORS 5.0 Vdc or 3.3 Vdc - LOW PROFILE ULTRA MINIATURE CERAMIC SURFACE MOUNT Source: http://www.abracon.com/Oscillators/asf1-L-L1.pdf; OC_FARNELL: unknown; OC_NEWARK: unknown; SKU: CTX270CT-ND
R1 R2 R5-R9 R11-R27 R29-R35 R38-R48 R50 R51 R55-R57 R62 R64 R66 = freetronics-master-v1:RESISTOR: Resistor Basic schematic elements and footprints for 0603, 1206, and PTH 1/10th watt (small) resistors.; PACKAGE: 0603
R3 R4 R36 R37 = rsense2:RSENSE
R10 = rcl:R-EU_: RESISTOR, European symbol; PACKAGE: 1W 2010
R63 = freetronics-master-v1:RESISTOR: Resistor Basic schematic elements and footprints for 0603, 1206, and PTH 1/10th watt (small) resistors.; PACKAGE: 1% 0603
U$1 U$2 U$5 U$55 U$56 U$68 = SparkFun:OSHW-LOGO: Open Source Hardware Logo This logo indicates the piece of hardware it is found on incorporates a OSHW license and/or adheres to the definition of open source hardware found here: http://freedomdefined.org/OSHW
X1 = con-phoenix-254:MPT6: PHOENIX CONNECTOR; OC_FARNELL: unknown; OC_NEWARK: unknown
X2 X3 = con-phoenix-254:MPT5: PHOENIX CONNECTOR; OC_FARNELL: unknown; OC_NEWARK: unknown
ZD1 = freetronics-luke:ZENER

## Board
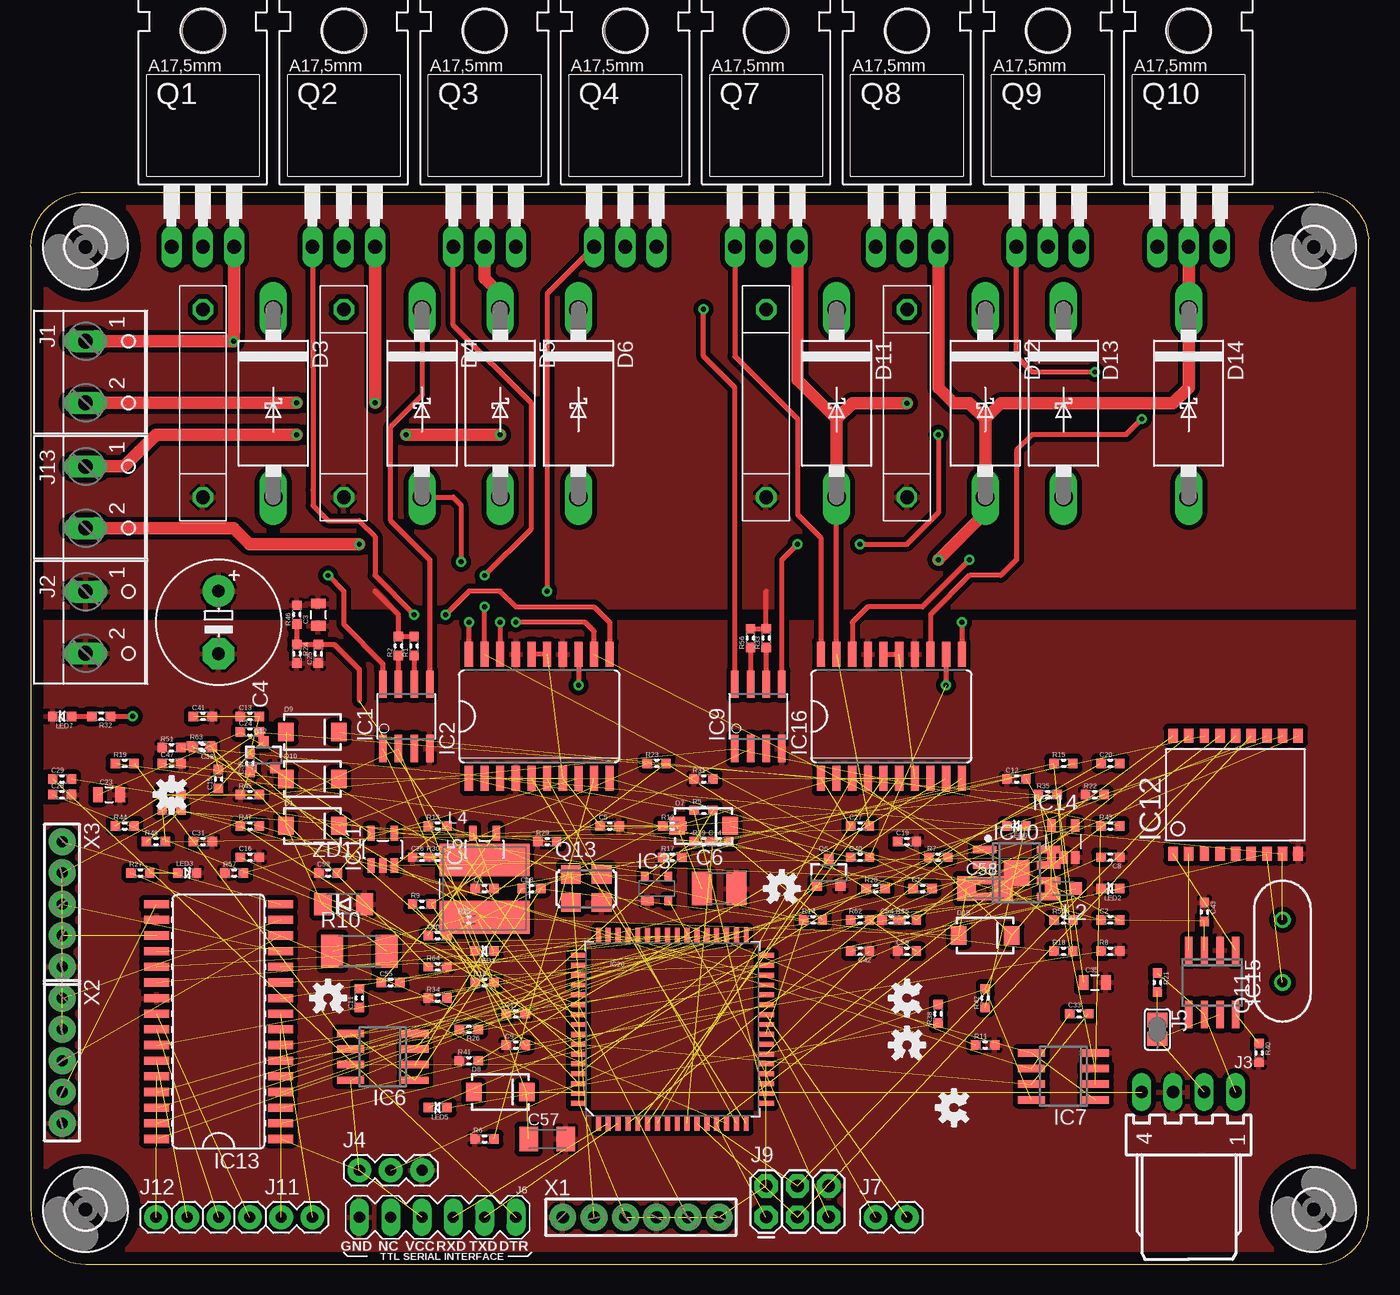
[diagram p5: board, top side]
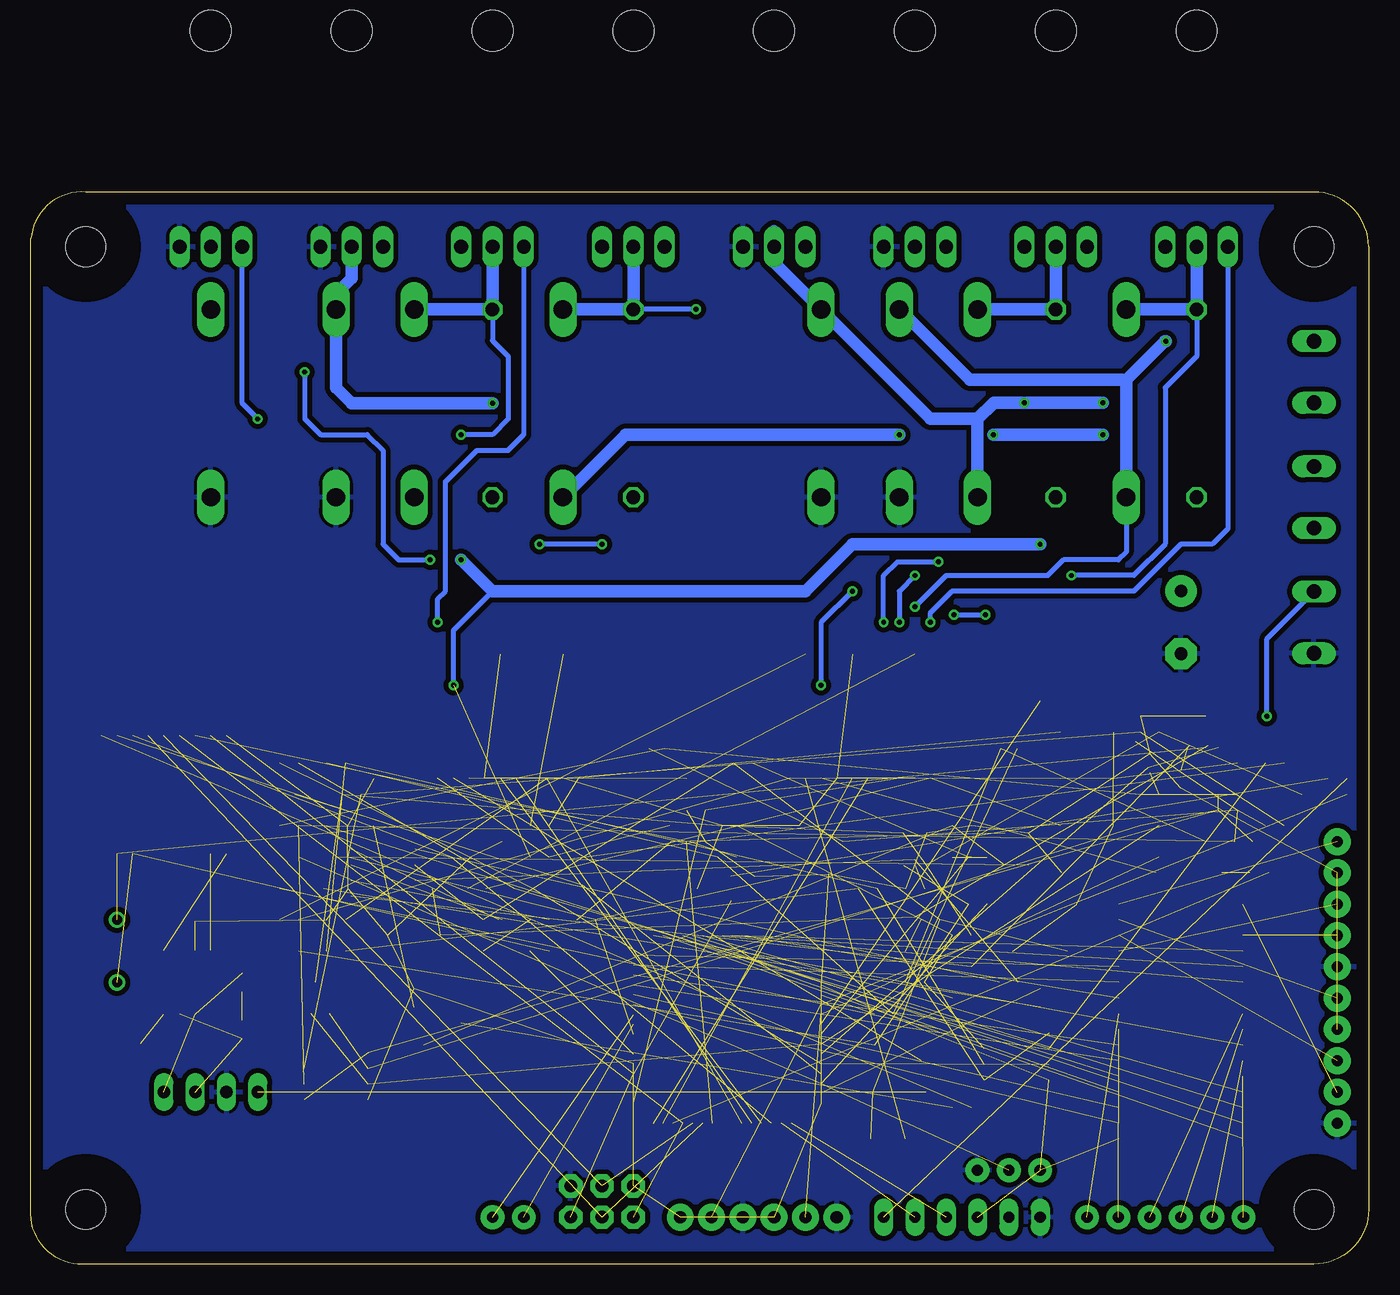
[diagram p6: board, bottom side, seen from below]

Size 108.6 x 87.01 mm. Coordinates in mm from the lower left corner, seen from the top.
Outline: 4.45,0 104.77,0 arc90 108.58,4.45 108.58,83.19 arc90 104.14,86.99 4.45,86.99 arc90 0,82.55 0,4.45 arc90 4.45,0
Copper layers (1*16): Top 0.035mm / dielectric 1.5mm / Bottom 0.035mm
Design rules "default": minimum track width 10mil, minimum drill 24mil, track to track 8mil, track to pad 8mil, pad to pad 8mil, via to via 8mil, smd to smd 8mil, copper to edge 40mil, drill to drill 8mil, minimum pad ring 10mil, minimum via ring 8mil, stop-mask expansion 4mil, vias tented up to drill 0mil, thermal gap 10mil

### Footprints (pad centres in the part's own frame; a part is rotated, then mirrored left to right if it is on the bottom)
0603 = smd 0.762 x 0.762: 1 -0.762,0; 2 0.762,0
0805 = smd 0.8 x 1.2: 1 -0.9,0; 2 0.9,0
E5-10,5 = drill 1.016 pad 2.54: + -2.54,0 | drill 1.016 pad 2.54 octagon: - 2.54,0
C1210 = smd 1.6 x 2.7: 1 -1.4,0; 2 1.4,0
C1206K = smd 1.5 x 2: 1 -1.5,0; 2 1.5,0
SMA-DIODE = smd 1.27 x 1.47: A -2.15,0; C 2.15,0
DO201T15 = drill 1.499 long: A 7.62,0; C -7.62,0
SMA = smd 1.27 x 1.47: A -2.15,0; K 2.15,0
3,2 = hole 3.2: 0,0
SO08 = smd 0.61 x 2.21: 1 -1.905,-2.616; 2 -0.635,-2.616; 3 0.635,-2.616; 4 1.905,-2.616; 5 1.905,2.616; 6 0.635,2.616; 7 -0.635,2.616; 8 -1.905,2.616
SO20W = smd 0.66 x 2.032: 1 -5.715,-5.029; 2 -4.445,-5.029; 3 -3.175,-5.029; 4 -1.905,-5.029; 5 -0.635,-5.029; 6 0.635,-5.029; 7 1.905,-5.029; 8 3.175,-5.029; 9 4.445,-5.029; 10 5.715,-5.029; 11 5.715,5.029; 12 4.445,5.029; 13 3.175,5.029; 14 1.905,5.029; 15 0.635,5.029; 16 -0.635,5.029; 17 -1.905,5.029; 18 -3.175,5.029; 19 -4.445,5.029; 20 -5.715,5.029
SOT143-R = smd 1 x 0.7: 1 -0.75,-1 | smd 0.6 x 0.7: 2 0.95,-1; 3 0.95,1; 4 -0.95,1
SOT23-5 = smd 0.6 x 1.2: 1 -0.95,-1.306; 2 0,-1.306; 3 0.95,-1.306; 4 0.95,1.306; 5 -0.95,1.306
SO08' = smd 0.6 x 2.2: 1 -1.905,-2.6; 2 -0.635,-2.6; 3 0.635,-2.6; 4 1.905,-2.6; 5 1.905,2.6; 6 0.635,2.6; 7 -0.635,2.6; 8 -1.905,2.6
SO08T = smd 1.905 x 0.6: 1 -2.6,1.905; 2 -2.6,0.635; 3 -2.6,-0.635; 4 -2.6,-1.905; 5 2.6,-1.905; 6 2.6,-0.635; 7 2.6,0.635; 8 2.6,1.905 | smd 2.057 x 2.057: 9 0,0
SO-18W = smd 0.762 x 1.143: 1 -5.08,-4.788; 2 -3.81,-4.788; 3 -2.54,-4.788; 4 -1.27,-4.788; 5 0,-4.788; 6 1.27,-4.788; 7 2.54,-4.788; 8 3.81,-4.788; 9 5.08,-4.788; 10 5.08,4.788; 11 3.81,4.788; 12 2.54,4.788; 13 1.27,4.788; 14 0,4.788; 15 -1.27,4.788; 16 -2.54,4.788; 17 -3.81,4.788; 18 -5.08,4.788
SO28W = smd 0.66 x 2.032: 1 -8.255,-5.029; 2 -6.985,-5.029; 3 -5.715,-5.029; 4 -4.445,-5.029; 5 -3.175,-5.029; 6 -1.905,-5.029; 7 -0.635,-5.029; 8 0.635,-5.029; 9 1.905,-5.029; 10 3.175,-5.029; 11 4.445,-5.029; 12 5.715,-5.029; 13 6.985,-5.029; 14 8.255,-5.029; 15 9.525,-5.029; 16 10.795,-5.029; 17 10.795,5.029; 18 9.525,5.029; 19 8.255,5.029; 20 6.985,5.029; 21 5.715,5.029; 22 4.445,5.029; 23 3.175,5.029; 24 1.905,5.029; 25 0.635,5.029; 26 -0.635,5.029; 27 -1.905,5.029; 28 -3.175,5.029; 29 -4.445,5.029; 30 -5.715,5.029; 31 -6.985,5.029; 32 -8.255,5.029
SOT23-5' = smd 0.69 x 0.99: 1 -0.95,-1.29; 2 0,-1.29; 3 0.95,-1.29; 4 0.95,1.3; 5 -0.95,1.3
SO-08 = smd 0.6 x 2.2: 1 -1.905,-2.6; 2 -0.635,-2.6; 3 0.635,-2.6; 4 1.905,-2.6; 5 1.905,2.6; 6 0.635,2.6; 7 -0.635,2.6; 8 -1.905,2.6
TQFP64_14X14MM = smd 0.4 x 1.27: 1 -6,-7.6; 2 -5.2,-7.6; 3 -4.4,-7.6; 4 -3.6,-7.6; 5 -2.8,-7.6; 6 -2,-7.6; 7 -1.2,-7.6; 8 -0.4,-7.6; 9 0.4,-7.6; 10 1.2,-7.6; 11 2,-7.6; 12 2.8,-7.6; 13 3.6,-7.6; 14 4.4,-7.6; 15 5.2,-7.6; 16 6,-7.6; 33 6,7.6; 34 5.2,7.6; 35 4.4,7.6; 36 3.6,7.6; 37 2.8,7.6; 38 2,7.6; 39 1.2,7.6; 40 0.4,7.6; 41 -0.4,7.6; 42 -1.2,7.6; 43 -2,7.6; 44 -2.8,7.6; 45 -3.6,7.6; 46 -4.4,7.6; 47 -5.2,7.6; 48 -6,7.6 | smd 1.27 x 0.4: 17 7.6,-6; 18 7.6,-5.2; 19 7.6,-4.4; 20 7.6,-3.6; 21 7.6,-2.8; 22 7.6,-2; 23 7.6,-1.2; 24 7.6,-0.4; 25 7.6,0.4; 26 7.6,1.2; 27 7.6,2; 28 7.6,2.8; 29 7.6,3.6; 30 7.6,4.4; 31 7.6,5.2; 32 7.6,6; 49 -7.6,6; 50 -7.6,5.2; 51 -7.6,4.4; 52 -7.6,3.6; 53 -7.6,2.8; 54 -7.6,2; 55 -7.6,1.2; 56 -7.6,0.4; 57 -7.6,-0.4; 58 -7.6,-1.2; 59 -7.6,-2; 60 -7.6,-2.8; 61 -7.6,-3.6; 62 -7.6,-4.4; 63 -7.6,-5.2; 64 -7.6,-6
W237-102 = drill 1.194 long: 1 -2.5,-1.27; 2 2.5,-1.27
7395-04 = drill 1.016 long: 1 3.81,0; 2 1.27,0; 3 -1.27,0; 4 -3.81,0
1X03 = drill 0.9 pad 1.93: 1 -2.54,0; 2 0,0; 3 2.54,0
SJ = smd 1.168 x 1.6: 1 -0.762,0; 2 0.762,0
1X06_LONGPADS = drill 0.9 pad 1.524 long: 1 0,0; 2 2.54,0; 3 5.08,0; 4 7.62,0; 5 10.16,0; 6 12.7,0
1X02 = drill 0.9 pad 1.93: 1 -1.27,0; 2 1.27,0
2X3 = drill 1.016 pad 1.88 octagon: 1 0,0; 2 0,2.54; 3 2.54,0; 4 2.54,2.54; 5 5.08,0; 6 5.08,2.54
1X04 = drill 0.9 pad 1.93: 1 -3.81,0; 2 -1.27,0; 3 1.27,0; 4 3.81,0
L2012C = smd 1 x 1: 1 -1,0; 2 1,0
CDRH = smd 7.3 x 2.65: 1 0,2.325; 2 0,-2.325
LED-0603 = smd 0.762 x 0.762: A -0.762,0; C 0.762,0
TO220BH = drill 1.118 long: D 0,-6.35; G -2.54,-6.35; S 2.54,-6.35 | hole 3.302: 0,11.176
SOT23-3 = smd 0.8 x 0.9: 1 -0.95,-1; 2 0.95,-1; 3 0,1.1
HC49US = drill 0.813: 1 -2.54,0; 2 2.54,0
ASF = smd 1.6 x 1.5: 1 -1.25,-1.15; 2 1.25,-1.15; 3 1.25,1.15; 4 -1.25,1.15
RSENSE = drill 1.1 octagon: P$1 -7.62,0; P$2 7.62,0
R2010 = smd 1.8 x 2.7: 1 -2.2,0; 2 2.2,0
6POL254 = drill 1 pad 2.184: 1 -6.35,0; 2 -3.81,0; 3 -1.27,0; 4 1.27,0; 5 3.81,0; 6 6.35,0
5POL254 = drill 0.9 pad 2.184: 1 -5.08,0; 2 -2.54,0; 3 0,0; 4 2.54,0; 5 5.08,0
MINIMELF = smd 1.4 x 1.8: A 1.7,0; K -1.7,0

### Placement (x,y rotation side)
C1  72.39,30.48 0 top
C2  87.63,27.94 0 top
C3  23.34,52.71 90 top
C4  15.24,52.07 270 top
C5  46.99,35.56 0 top
C6  55.88,30.48 0 top
C7  36.83,30.48 0 top
C8  87.63,33.02 180 top
C9  39.37,17.78 0 top
C10  33.02,26.67 0 top
C11  26.67,21.59 90 top
C12  80.01,39.37 0 top
C13  17.78,44.45 0 top
C14  55.88,34.29 0 top
C15  15.24,39.37 90 top
C16  17.78,33.02 0 top
C17  39.37,20.32 0 top
C18  40.64,30.48 0 top
C19  71.12,34.29 0 top
C20  87.63,40.64 0 top
C23  6.35,38.1 0 top
C24  17.78,43.18 0 top
C25  23.34,49.53 90 top
C26  31.75,33.02 0 top
C27  67.31,35.56 0 top
C28  2.54,38.1 0 top
C29  2.54,39.37 0 top
C30  11.43,38.1 0 top
C31  13.97,34.29 0 top
C32  11.43,36.83 0 top
C33  85.09,20.32 0 top
C34  11.43,36.83 0 top
C35  86.36,22.86 0 top
C38  13.97,41.91 180 top
C39  17.78,40.64 90 top
C40  67.31,33.02 0 top
C41  13.97,44.45 0 top
C42  67.31,25.4 180 top
C43  95.25,28.57 270 top
C47  11.43,40.64 0 top
C53  24.13,31.75 0 top
C54  69.85,27.94 0 top
C55  29.21,22.86 0 top
C57  41.91,10.16 0 top
C58  77.47,30.48 0 top
C59  71.12,25.4 0 top
D1  22.86,35.56 0 top
D3  19.68,69.85 270 top
D4  31.75,69.85 270 top
D5  38.1,69.85 270 top
D6  44.45,69.85 270 top
D7  54.61,35.56 0 top
D8  38.1,13.97 0 top
D9  22.86,43.18 0 top
D10  22.86,39.37 0 top
D11  65.41,69.85 270 top
D12  77.47,69.85 270 top
D13  83.82,69.85 270 top
D14  93.98,69.85 270 top
D18  77.47,26.67 0 top
H1  104.14,4.45 0 top
H2  4.45,82.55 0 top
H3  104.14,82.55 0 top
H4  4.45,4.45 0 top
IC1  30.48,44.45 0 top
IC2  41.28,44.45 0 top
IC3  50.8,30.48 0 top
IC5  36.83,33.66 0 top
IC6  OPA2336UA  [SO08']  28.57,16.83 90 top
IC7  OPA2336UA  [SO08']  83.82,15.24 90 top
IC9  59.05,44.45 0 top
IC10  80.01,31.75 0 top
IC11  28.57,33.66 0 top
IC12  97.79,38.1 0 top
IC13  15.24,18.41 90 top
IC14  SN74AHCT1G86DBVR  [SOT23-5']  83.82,34.29 0 top
IC15  95.88,22.86 180 top
IC16  69.85,44.45 0 top
IC20  52.07,19.05 0 top
J1  5.71,72.39 270 top
J2  5.71,52.07 270 top
J3  93.98,13.97 0 top
J4  29.21,7.62 0 top
J5  91.44,19.05 270 top
J6  39.37,3.81 180 top
J7  69.85,3.81 0 top
J9  59.69,3.81 0 top
J11  21.59,3.81 0 top
J12  13.97,3.81 0 top
J13  5.71,62.23 270 top
L2  83.82,30.48 180 top
L4  36.83,30.48 0 top
LED1  36.83,25.4 180 top
LED2  87.63,30.48 180 top
LED3  12.7,31.75 0 top
LED5  33.02,12.7 180 top
LED6  80.01,35.56 180 top
LED7  2.54,44.45 180 top
Q1  13.97,88.9 0 top
Q2  25.4,88.9 0 top
Q3  36.83,88.9 0 top
Q4  48.26,88.9 0 top
Q6  64.77,31.75 0 top
Q7  59.69,88.9 0 top
Q8  71.12,88.9 0 top
Q9  82.55,88.9 0 top
Q10  93.98,88.9 0 top
Q11  101.6,25.4 90 top
Q12  18.89,41.28 0 top
Q13  45.09,30.48 0 top
R1  31.11,50.17 90 top
R2  29.84,50.17 90 top
R3  13.97,69.85 270 top
R4  25.4,69.85 270 top
R5  54.61,36.83 0 top
R6  36.83,10.16 0 top
R7  73.66,33.02 0 top
R8  87.63,25.4 0 top
R9  31.75,29.21 0 top
R10  26.67,25.4 0 top
R11  77.47,17.78 0 top
R12  52.07,35.56 0 top
R13  33.02,35.56 0 top
R14  63.5,27.94 0 top
R15  83.82,40.64 0 top
R16  36.83,22.86 0 top
R17  52.07,33.02 0 top
R18  83.82,25.4 0 top
R19  7.62,40.64 0 top
R20  68.58,30.48 0 top
R21  91.44,22.86 270 top
R22  86.36,38.1 0 top
R23  50.8,40.64 0 top
R24  21.59,49.53 270 top
R25  35.56,27.94 0 top
R26  35.56,19.05 180 top
R27  8.89,31.75 0 top
R29  41.91,34.29 0 top
R30  33.02,33.02 0 top
R31  54.61,39.37 0 top
R32  5.71,44.45 180 top
R33  59.69,50.8 90 top
R34  33.02,21.59 0 top
R35  82.55,38.1 0 top
R36  59.69,69.85 270 top
R37  71.12,69.85 270 top
R38  73.66,20.32 90 top
R39  54.61,34.29 0 top
R40  99.69,17.14 270 top
R41  35.56,16.51 0 top
R42  77.47,21.59 90 top
R43  87.63,35.56 0 top
R44  7.62,35.56 0 top
R45  17.78,38.1 0 top
R46  21.59,52.71 90 top
R47  17.78,35.56 0 top
R48  10.16,34.29 0 top
R50  11.43,36.83 0 top
R51  11.43,41.91 0 top
R55  83.82,27.94 0 top
R56  58.42,50.8 90 top
R57  16.51,31.75 0 top
R62  67.31,27.94 0 top
R63  13.81,42.07 0 top
R64  33.02,24.13 0 top
R66  71.12,27.94 0 top
U$1  74.93,12.7 90 top
U$2  71.12,21.59 90 top
U$5  11.43,38.1 90 top
U$55  60.96,30.48 0 top
U$56  71.12,17.78 0 top
U$68  24.13,21.59 0 top
X1  49.53,3.81 0 top
X2  2.54,16.51 270 top
X3  2.54,29.21 270 top
ZD1  25.4,29.21 0 top

### Tracks (layer width: path | path; a pad name or v marks a point on that pad's centre or on a via)
24V_MEASURE  (3 unrouted)
60V_MEASURE  (1 unrouted)
  Top 0.406: R46.1 R24.1 C25.2 24.64,50.29 26.67,48.26 26.67,45.72
!CAN_CS  (2 unrouted)
!CAN_INT  (2 unrouted)
!RESET  (3 unrouted)
+5V  (38 unrouted)
+5VA  (1 unrouted)
+12V  (14 unrouted)
  Top 0.406: IC2.15 IC2.16 | IC16.16 IC16.15
+24V  (6 unrouted)
+60V  (via drill 0.4)
  Top 0.406: R1.2 R2.2 29.84,52.71 27.94,54.61 | R56.2 R33.2 59.69,54.61 | R32.1 v8.26,44.45
  Bottom 0.406: v8.26,44.45 8.26,50.76 J2.1
  pour Top (isolate 0.406): -1.27,87.63 -1.27,53.34 109.22,53.34 109.22,87.63
AGND  (1 unrouted)
AREF  (3 unrouted)
AREF/2  (7 unrouted)
BRIDGE_1_A  (1 unrouted)
BRIDGE_1_B  (1 unrouted)
BRIDGE_1_DIS  (2 unrouted)
BRIDGE_2_A  (1 unrouted)
BRIDGE_2_B  (1 unrouted)
BRIDGE_2_DIS  (2 unrouted)
CANH  (2 unrouted)
CANL  (2 unrouted)
CH1_CURRENT_SENSE  (3 unrouted)
CH1_GAIN_SELECT  (2 unrouted)
CH2_CURRENT_SENSE  (3 unrouted)
CH2_GAIN_SELECT  (2 unrouted)
CHAX  (1 unrouted)
CHAY  (1 unrouted)
CHBX  (1 unrouted)
CHBY  (1 unrouted)
CHIX  (1 unrouted)
CHIY  (1 unrouted)
D0  (1 unrouted)
D1  (1 unrouted)
D2  (1 unrouted)
D3  (1 unrouted)
D4  (1 unrouted)
D5  (1 unrouted)
D6  (1 unrouted)
D7  (1 unrouted)
DECODER_CLK  (1 unrouted)
DECODER_EN  (1 unrouted)
DIFF_OUT_1A  (3 unrouted)
DIFF_OUT_1B  (3 unrouted)
DIFF_OUT_2A  (3 unrouted)
DIFF_OUT_2B  (3 unrouted)
EN1  (1 unrouted)
EN2  (1 unrouted)
GND  (8 unrouted)
  pour Top (isolate 0.406): -1.27,52.07 109.22,52.07 109.22,-1.27 -1.27,-1.27
  pour Bottom (isolate 0.406): -1.27,87.63 109.22,87.63 109.22,-1.27 -1.27,-1.27
LED  (1 unrouted)
MAIN_CLK  (3 unrouted)
MISO  (2 unrouted)
MOSI  (2 unrouted)
N$1  (1 unrouted)
N$2  (3 unrouted)
N$3  (2 unrouted)
N$4  (1 unrouted)
N$5  (2 unrouted)
N$6
  Top 0.406: IC1.7 R2.1
N$7  (1 unrouted)
N$8  (1 unrouted)
N$9  (1 unrouted)
N$10  (1 unrouted)
N$11  (3 unrouted)
N$12  (1 unrouted)
N$13  (1 unrouted)
N$14  (3 unrouted)
N$15
  Top 0.406: R1.1 IC1.6
N$16  (3 unrouted)
N$17  (1 unrouted)
N$18  (3 unrouted)
N$19  (1 unrouted)
N$20  (1 unrouted)
N$22  (3 unrouted)
N$23  (1 unrouted)
N$24  (1 unrouted)
N$25  (3 unrouted)
N$30  (1 unrouted)
N$31  (1 unrouted)
N$35  (3 unrouted)
N$36  (1 unrouted)
N$37  (via drill 0.4)  (1 unrouted)
  Top 0.406: IC2.12 45.72,51.36 45.01,52.07 v39.37,52.07 | D4.A 34.29,62.23 34.93,61.6 v34.93,56.99
  Top 1.016: J1.2 v21.59,69.89 | Q2.S v27.94,69.89
  Bottom 0.406: v39.37,52.07 39.37,55.88 38.26,56.99 v34.93,56.99
  Bottom 1.016: 48.26,83.82 Q4.D 48.26,81.28 D6.C 35.56,68.58 31.75,68.58 | v21.59,69.89 v27.94,69.89 30.44,69.89 31.75,68.58 | 31.75,68.58 D4.A
N$38  (3 unrouted)
N$40
  Top 0.406: D4.C 31.75,70.48 29.21,67.94 29.21,60.33 32.34,57.19 32.38,57.19 IC1.5
  Bottom 1.016: Q2.D R4.P$1 D4.C
N$41  (via drill 0.4)  (1 unrouted)
  Top 0.406: IC2.19 v36.83,53.34
  Top 1.016: D5.C 38.1,78.74 36.83,80.01 Q3.D | J1.1 v16.47,74.89 16.51,76.2 Q1.S
  Bottom 0.406: v36.83,53.34 34.29,55.88 26.04,55.88 24.77,57.15 20.32,57.15 19.68,57.79 D3.A
  Bottom 1.016: v16.47,74.89 16.55,74.89 19.68,71.75 | 19.68,71.75 D3.A | 19.68,71.75 32.38,71.75 D5.C
N$42  (1 unrouted)
N$43  (1 unrouted)
N$44  (2 unrouted)
N$45  (via drill 0.4)
  Top 0.406: v24.13,55.88 25.4,54.61 25.4,51.91 28.57,48.74 IC1.8
  Bottom 0.406: R3.P$1 13.97,73.66 16.51,71.12 16.51,58.42 19.05,55.88 v24.13,55.88
  Bottom 1.016: Q1.D R3.P$1 D3.C
N$46  (via drill 0.4)
  Top 0.406: IC2.20 v35.56,52.07
  Bottom 0.406: Q1.G 11.43,59.69 12.7,58.42 15.24,58.42 19.05,54.61 33.81,54.61 35.56,52.86 v35.56,52.07
N$47  (via drill 0.4)
  Top 0.406: v38.1,52.07 IC2.18 | v36.83,55.88 40.64,59.69 40.64,69.85 34.29,76.2 Q3.G
  Bottom 0.406: v36.83,55.88 38.1,54.61 v38.1,52.07
N$48  (via drill 0.4)
  Top 0.406: IC2.13 v44.45,46.99 | v41.91,54.61 41.91,78.74 Q4.G
  Bottom 0.406: v41.91,54.61 44.45,52.07 v44.45,46.99
N$49  (via drill 0.4)
  Top 0.406: Q2.G 22.9,62.83 22.9,61.55 24.13,60.33 26.67,60.33 27.94,59.05 27.94,55.88 v31.11,52.71 | IC2.11 46.99,52.07 45.72,53.34 39.37,53.34 38.1,54.61 35.56,54.61 v33.66,52.71
  Bottom 0.406: v33.66,52.71 v31.11,52.71
N$50  (1 unrouted)
N$51  (1 unrouted)
N$53  (1 unrouted)
N$54  (1 unrouted)
N$55
  Top 0.406: LED7.A R32.2
N$56  (2 unrouted)
N$57  (2 unrouted)
N$58  (1 unrouted)
N$59  (1 unrouted)
N$60  (2 unrouted)
N$61  (1 unrouted)
N$62  (1 unrouted)
N$63  (2 unrouted)
N$65  (3 unrouted)
N$66  (2 unrouted)
N$71  (via drill 0.4)  (1 unrouted)
  Top 0.406: IC16.12 v74.3,46.99
  Top 1.016: 77.47,68.58 78.74,69.85 92.71,69.85 93.98,71.12 D14.C Q10.D | 77.47,68.58 D12.A 77.47,60.96 v73.66,57.15 | Q8.S 73.66,71.12 74.93,69.85 76.2,69.85 77.47,68.58 | J13.2 16.47,59.73 17.78,58.42 v26.67,58.42
  Bottom 0.406: v74.3,46.99 74.3,51.44 71.12,54.61
  Bottom 1.016: v73.66,57.15 71.12,54.61 45.72,54.61 41.91,58.42 v26.67,58.42
N$74  (via drill 0.4)
  Top 0.406: IC9.5 60.96,57.15 v62.23,58.42 | v67.31,58.42 71.12,58.42 73.66,60.96 v73.66,67.31
  Bottom 0.406: v62.23,58.42 v67.31,58.42 | R37.P$1 71.12,74.93 69.85,73.66 69.85,68.58 71.12,67.31 v73.66,67.31
  Bottom 1.016: D12.C R37.P$1 Q8.D
N$75  (via drill 0.4)  (1 unrouted)
  Top 0.406: IC16.19 D11.A
  Top 1.016: Q7.S 62.23,71.75 65.41,68.58 | v71.12,69.85 66.67,69.85 65.41,68.58 | 65.41,68.58 D11.A | J13.1 7.58,64.73 10.16,67.31 v21.59,67.31 | v30.48,67.31 v38.1,67.31
  Bottom 1.016: v71.12,69.85 82.55,69.85 83.82,71.12 D13.C 83.82,78.74 82.55,80.01 Q9.D | v21.59,67.31 v30.48,67.31 | D11.A 60.33,67.31 52.07,67.31 v38.1,67.31
N$76  (1 unrouted)
N$77  (1 unrouted)
N$80  (via drill 0.4)
  Top 0.406: IC9.8 57.15,71.12 54.61,73.66 v54.61,77.47
  Bottom 0.406: v54.61,77.47 R36.P$1
  Bottom 1.016: Q7.D R36.P$1 D11.C
N$81
  Top 0.406: Q7.G 57.15,73.66 62.23,68.58 62.23,60.84 64.14,58.94 IC16.20
N$82  (via drill 0.4)
  Top 0.406: v86.36,72.39 81.28,72.39 80.01,73.66 Q9.G | v76.2,57.15 72.39,53.34 67.94,53.34 66.67,52.07 IC16.18
  Bottom 0.406: v86.36,72.39 86.36,68.58 85.09,67.31 81.28,67.31 80.01,66.04 80.01,58.42 78.74,57.15 v76.2,57.15
N$83  (via drill 0.4)
  Top 0.406: IC16.13 73.02,52.71 76.2,55.88 78.74,55.88 80.01,57.15 80.01,66.04 81.28,67.31 88.9,67.31 v90.17,68.58
  Bottom 0.406: v90.17,68.58 91.44,69.85 Q10.G
N$84  (1 unrouted)
N$85  (1 unrouted)
N$86  (1 unrouted)
N$87  (1 unrouted)
N$88  (via drill 0.4)
  Top 0.406: v75.56,52.07 IC16.11
  Bottom 0.406: Q8.G 68.58,67.31 69.85,66.04 72.39,66.04 74.93,63.5 74.93,54.61 75.56,53.98 v75.56,52.07
N$89  (2 unrouted)
N$93  (2 unrouted)
N$94  (1 unrouted)
N$95  (1 unrouted)
N$96
  Top 0.406: R56.1 IC9.7
N$97
  Top 0.406: R33.1 IC9.6
POT1  (2 unrouted)
POT2  (2 unrouted)
RSTX  (1 unrouted)
RSTY  (1 unrouted)
RXD  (1 unrouted)
SCK  (2 unrouted)
SEL1  (1 unrouted)
SEL2  (1 unrouted)
TXD  (1 unrouted)
X/Y  (1 unrouted)